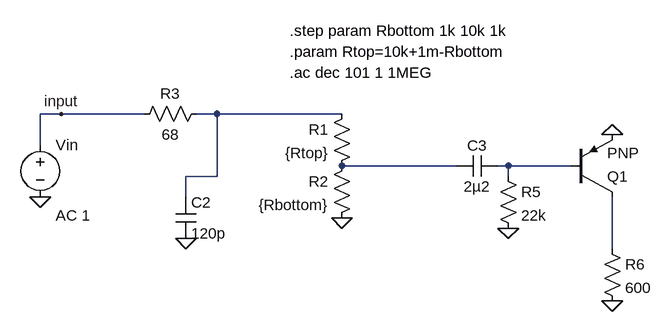
[diagram p0: schematic input.asc]
input.asc, the LTspice schematic file:
Version 4
SHEET 1 880 680
WIRE -352 48 -384 48
WIRE -224 48 -352 48
WIRE -112 48 -144 48
WIRE 80 48 -112 48
WIRE -384 96 -384 48
WIRE 256 128 80 128
WIRE 336 128 320 128
WIRE 432 128 336 128
WIRE -112 144 -112 48
WIRE -112 144 -160 144
WIRE 336 144 336 128
WIRE -160 176 -160 144
WIRE 496 256 496 176
FLAG 80 208 0
FLAG 496 336 0
FLAG 336 224 0
FLAG -384 176 0
FLAG -352 48 input
FLAG 496 80 0
FLAG -160 240 0
SYMBOL res 96 32 M0
SYMATTR InstName R1
SYMATTR Value {Rtop}
SYMBOL res 96 112 M0
SYMATTR InstName R2
SYMATTR Value {Rbottom}
SYMBOL cap -176 176 R0
SYMATTR InstName C2
SYMATTR Value 120p
SYMBOL cap 320 112 R90
WINDOW 0 0 32 VBottom 2
WINDOW 3 32 32 VTop 2
SYMATTR InstName C3
SYMATTR Value 2µ2
SYMBOL res 320 128 R0
SYMATTR InstName R5
SYMATTR Value 22k
SYMBOL pnp 432 176 M180
SYMATTR InstName Q1
SYMBOL res 480 240 R0
SYMATTR InstName R6
SYMATTR Value 600
SYMBOL voltage -384 80 R0
WINDOW 123 24 124 Left 2
WINDOW 39 0 0 Left 0
SYMATTR Value2 AC 1
SYMATTR InstName Vin
SYMATTR Value ""
SYMBOL res -128 32 R90
WINDOW 0 0 56 VBottom 2
WINDOW 3 32 56 VTop 2
SYMATTR InstName R3
SYMATTR Value 68
TEXT 0 -80 Left 2 !.step param Rbottom 1k 10k 1k
TEXT 0 -48 Left 2 !.param Rtop=10k+1m-Rbottom
TEXT 0 -16 Left 2 !.ac dec 101 1 1MEG

The netlist it stands for:
* input.asc
R1 N001 N002 {Rtop}
R2 N002 0 {Rbottom}
C2 N001 0 120p
C3 N003 N002 2µ2
R5 N003 0 22k
Q1 N004 N003 0 0 PNP
R6 N004 0 600
Vin input 0 AC 1
R3 N001 input 68
.model NPN NPN
.model PNP PNP
.lib standard.bjt
.step param Rbottom 1k 10k 1k
.param Rtop=10k+1m-Rbottom
.ac dec 101 1 1MEG
.backanno
.end